# EAGLE design schemat (EAGLE 8.4.3)
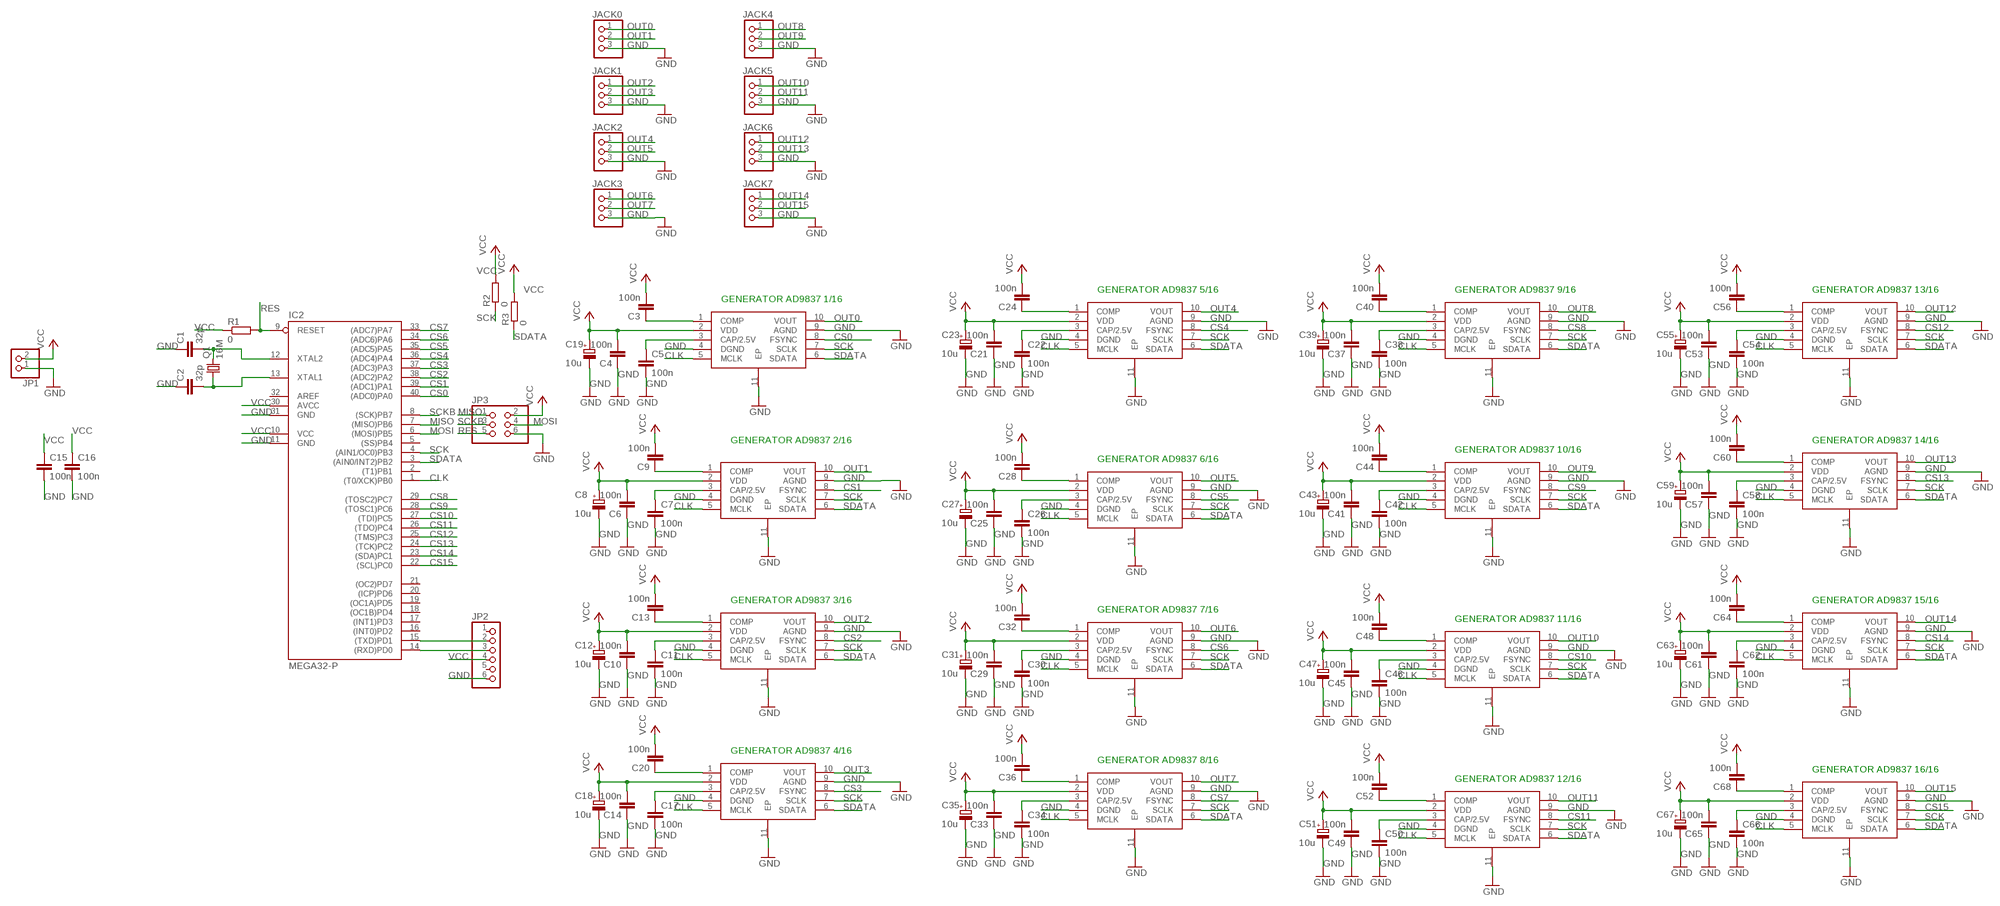
[diagram p0: schematic, sheet 1]

## Parts
C1  32p  C-EUC1206  [C1206]
C2  32p  C-EUC1206  [C1206]
C3  100n  C-EUC1206  [C1206]
C4  100n  C-EUC1206  [C1206]
C5  100n  C-EUC1206  [C1206]
C6  100n  C-EUC1206  [C1206]
C7  100n  C-EUC1206  [C1206]
C8  10u  CPOL-EUSMCB  [SMC_B]
C9  100n  C-EUC1206  [C1206]
C10  100n  C-EUC1206  [C1206]
C11  100n  C-EUC1206  [C1206]
C12  10u  CPOL-EUSMCB  [SMC_B]
C13  100n  C-EUC1206  [C1206]
C14  100n  C-EUC1206  [C1206]
C15  100n  C-EUC1206  [C1206]
C16  100n  C-EUC1206  [C1206]
C17  100n  C-EUC1206  [C1206]
C18  10u  CPOL-EUSMCB  [SMC_B]
C19  10u  CPOL-EUSMCB  [SMC_B]
C20  100n  C-EUC1206  [C1206]
C21  100n  C-EUC1206  [C1206]
C22  100n  C-EUC1206  [C1206]
C23  10u  CPOL-EUSMCB  [SMC_B]
C24  100n  C-EUC1206  [C1206]
C25  100n  C-EUC1206  [C1206]
C26  100n  C-EUC1206  [C1206]
C27  10u  CPOL-EUSMCB  [SMC_B]
C28  100n  C-EUC1206  [C1206]
C29  100n  C-EUC1206  [C1206]
C30  100n  C-EUC1206  [C1206]
C31  10u  CPOL-EUSMCB  [SMC_B]
C32  100n  C-EUC1206  [C1206]
C33  100n  C-EUC1206  [C1206]
C34  100n  C-EUC1206  [C1206]
C35  10u  CPOL-EUSMCB  [SMC_B]
C36  100n  C-EUC1206  [C1206]
C37  100n  C-EUC1206  [C1206]
C38  100n  C-EUC1206  [C1206]
C39  10u  CPOL-EUSMCB  [SMC_B]
C40  100n  C-EUC1206  [C1206]
C41  100n  C-EUC1206  [C1206]
C42  100n  C-EUC1206  [C1206]
C43  10u  CPOL-EUSMCB  [SMC_B]
C44  100n  C-EUC1206  [C1206]
C45  100n  C-EUC1206  [C1206]
C46  100n  C-EUC1206  [C1206]
C47  10u  CPOL-EUSMCB  [SMC_B]
C48  100n  C-EUC1206  [C1206]
C49  100n  C-EUC1206  [C1206]
C50  100n  C-EUC1206  [C1206]
C51  10u  CPOL-EUSMCB  [SMC_B]
C52  100n  C-EUC1206  [C1206]
C53  100n  C-EUC1206  [C1206]
C54  100n  C-EUC1206  [C1206]
C55  10u  CPOL-EUSMCB  [SMC_B]
C56  100n  C-EUC1206  [C1206]
C57  100n  C-EUC1206  [C1206]
C58  100n  C-EUC1206  [C1206]
C59  10u  CPOL-EUSMCB  [SMC_B]
C60  100n  C-EUC1206  [C1206]
C61  100n  C-EUC1206  [C1206]
C62  100n  C-EUC1206  [C1206]
C63  10u  CPOL-EUSMCB  [SMC_B]
C64  100n  C-EUC1206  [C1206]
C65  100n  C-EUC1206  [C1206]
C66  100n  C-EUC1206  [C1206]
C67  10u  CPOL-EUSMCB  [SMC_B]
C68  100n  C-EUC1206  [C1206]
GEN1  AD9837  [SON50P300X300X80-11N]
GEN2  AD9837  [SON50P300X300X80-11N]
GEN3  AD9837  [SON50P300X300X80-11N]
GEN4  AD9837  [SON50P300X300X80-11N]
GEN5  AD9837  [SON50P300X300X80-11N]
GEN6  AD9837  [SON50P300X300X80-11N]
GEN7  AD9837  [SON50P300X300X80-11N]
GEN8  AD9837  [SON50P300X300X80-11N]
GEN9  AD9837  [SON50P300X300X80-11N]
GEN10  AD9837  [SON50P300X300X80-11N]
GEN11  AD9837  [SON50P300X300X80-11N]
GEN12  AD9837  [SON50P300X300X80-11N]
GEN13  AD9837  [SON50P300X300X80-11N]
GEN14  AD9837  [SON50P300X300X80-11N]
GEN15  AD9837  [SON50P300X300X80-11N]
GEN16  AD9837  [SON50P300X300X80-11N]
IC2  MEGA32-P  [DIL40]
JACK0  PINHD-1X3  [1X03]
JACK1  PINHD-1X3  [1X03]
JACK2  PINHD-1X3  [1X03]
JACK3  PINHD-1X3  [1X03]
JACK4  PINHD-1X3  [1X03]
JACK5  PINHD-1X3  [1X03]
JACK6  PINHD-1X3  [1X03]
JACK7  PINHD-1X3  [1X03]
JP1  PINHD-1X2  [1X02]
JP2  PINHD-1X6  [1X06]
JP3  PINHD-2X3  [2X03]
Q1  16M  CRYSTALHC49S  [HC49/S]
R1  0  R-EU_R1206  [R1206]
R2  0  R-EU_M1206  [M1206]
R3  0  R-EU_M1206  [M1206]

## Nets
CLK: GEN1.5(MCLK) GEN2.5(MCLK) GEN3.5(MCLK) GEN4.5(MCLK) GEN5.5(MCLK) GEN6.5(MCLK) GEN7.5(MCLK) GEN8.5(MCLK) GEN9.5(MCLK) GEN10.5(MCLK) GEN11.5(MCLK) GEN12.5(MCLK) GEN13.5(MCLK) GEN14.5(MCLK) GEN15.5(MCLK) GEN16.5(MCLK) IC2.1((T0/XCK)PB0)
CS0: GEN1.8(FSYNC) IC2.40((ADC0)PA0)
CS1: GEN2.8(FSYNC) IC2.39((ADC1)PA1)
CS2: GEN3.8(FSYNC) IC2.38((ADC2)PA2)
CS3: GEN4.8(FSYNC) IC2.37((ADC3)PA3)
CS4: GEN5.8(FSYNC) IC2.36((ADC4)PA4)
CS5: GEN6.8(FSYNC) IC2.35((ADC5)PA5)
CS6: GEN7.8(FSYNC) IC2.34((ADC6)PA6)
CS7: GEN8.8(FSYNC) IC2.33((ADC7)PA7)
CS8: GEN9.8(FSYNC) IC2.29((TOSC2)PC7)
CS9: GEN10.8(FSYNC) IC2.28((TOSC1)PC6)
CS10: GEN11.8(FSYNC) IC2.27((TDI)PC5)
CS11: GEN12.8(FSYNC) IC2.26((TDO)PC4)
CS12: GEN13.8(FSYNC) IC2.25((TMS)PC3)
CS13: GEN14.8(FSYNC) IC2.24((TCK)PC2)
CS14: GEN15.8(FSYNC) IC2.23((SDA)PC1)
CS15: GEN16.8(FSYNC) IC2.22((SCL)PC0)
GND: C1.1 C2.1 C4.1 C5.2 C6.1 C7.2 C8.- C10.1 C11.2 C12.- C14.1 C15.2 C16.2 C17.2 C18.- C19.- C21.1 C22.2 C23.- C25.1 C26.2 C27.- C29.1 C30.2 C31.- C33.1 C34.2 C35.- C37.1 C38.2 C39.- C41.1 C42.2 C43.- C45.1 C46.2 C47.- C49.1 C50.2 C51.- C53.1 C54.2 C55.- C57.1 C58.2 C59.- C61.1 C62.2 C63.- C65.1 C66.2 C67.- GEN1.4(DGND) GEN1.9(AGND) GEN1.11(EP) GEN2.4(DGND) GEN2.9(AGND) GEN2.11(EP) GEN3.4(DGND) GEN3.9(AGND) GEN3.11(EP) GEN4.4(DGND) GEN4.9(AGND) GEN4.11(EP) GEN5.4(DGND) GEN5.9(AGND) GEN5.11(EP) GEN6.4(DGND) GEN6.9(AGND) GEN6.11(EP) GEN7.4(DGND) GEN7.9(AGND) GEN7.11(EP) GEN8.4(DGND) GEN8.9(AGND) GEN8.11(EP) GEN9.4(DGND) GEN9.9(AGND) GEN9.11(EP) GEN10.4(DGND) GEN10.9(AGND) GEN10.11(EP) GEN11.4(DGND) GEN11.9(AGND) GEN11.11(EP) GEN12.4(DGND) GEN12.9(AGND) GEN12.11(EP) GEN13.4(DGND) GEN13.9(AGND) GEN13.11(EP) GEN14.4(DGND) GEN14.9(AGND) GEN14.11(EP) GEN15.4(DGND) GEN15.9(AGND) GEN15.11(EP) GEN16.4(DGND) GEN16.9(AGND) GEN16.11(EP) IC2.11(GND) IC2.31(GND) JACK0.3 JACK1.3 JACK2.3 JACK3.3 JACK4.3 JACK5.3 JACK6.3 JACK7.3 JP1.1 JP2.6 JP3.6
MISO: IC2.7((MISO)PB6) JP3.1
MOSI: IC2.6((MOSI)PB5) JP3.4
N$1: C7.1 GEN2.3(CAP/2.5V)
N$2: C9.1 GEN2.1(COMP)
N$3: C1.2 IC2.12(XTAL2) Q1.2
N$4: C2.2 IC2.13(XTAL1) Q1.1
N$6: C5.1 GEN1.3(CAP/2.5V)
N$7: C11.1 GEN3.3(CAP/2.5V)
N$8: C13.1 GEN3.1(COMP)
N$9: C17.1 GEN4.3(CAP/2.5V)
N$10: C20.1 GEN4.1(COMP)
N$11: C22.1 GEN5.3(CAP/2.5V)
N$12: C24.1 GEN5.1(COMP)
N$14: C3.1 GEN1.1(COMP)
N$15: C26.1 GEN6.3(CAP/2.5V)
N$16: C28.1 GEN6.1(COMP)
N$17: C30.1 GEN7.3(CAP/2.5V)
N$18: C32.1 GEN7.1(COMP)
N$19: C34.1 GEN8.3(CAP/2.5V)
N$20: C36.1 GEN8.1(COMP)
N$21: C38.1 GEN9.3(CAP/2.5V)
N$22: C40.1 GEN9.1(COMP)
N$23: C42.1 GEN10.3(CAP/2.5V)
N$24: C44.1 GEN10.1(COMP)
N$25: C46.1 GEN11.3(CAP/2.5V)
N$26: C48.1 GEN11.1(COMP)
N$27: C50.1 GEN12.3(CAP/2.5V)
N$28: C52.1 GEN12.1(COMP)
N$29: C54.1 GEN13.3(CAP/2.5V)
N$30: C56.1 GEN13.1(COMP)
N$31: C58.1 GEN14.3(CAP/2.5V)
N$32: C60.1 GEN14.1(COMP)
N$33: C62.1 GEN15.3(CAP/2.5V)
N$34: C64.1 GEN15.1(COMP)
N$35: C66.1 GEN16.3(CAP/2.5V)
N$36: C68.1 GEN16.1(COMP)
N$37: IC2.15((TXD)PD1) JP2.2
N$38: IC2.14((RXD)PD0) JP2.3
OUT0: GEN1.10(VOUT) JACK0.1
OUT1: GEN2.10(VOUT) JACK0.2
OUT2: GEN3.10(VOUT) JACK1.1
OUT3: GEN4.10(VOUT) JACK1.2
OUT4: GEN5.10(VOUT) JACK2.1
OUT5: GEN6.10(VOUT) JACK2.2
OUT6: GEN7.10(VOUT) JACK3.1
OUT7: GEN8.10(VOUT) JACK3.2
OUT8: GEN9.10(VOUT) JACK4.1
OUT9: GEN10.10(VOUT) JACK4.2
OUT10: GEN11.10(VOUT) JACK5.1
OUT11: GEN12.10(VOUT) JACK5.2
OUT12: GEN13.10(VOUT) JACK6.1
OUT13: GEN14.10(VOUT) JACK6.2
OUT14: GEN15.10(VOUT) JACK7.1
OUT15: GEN16.10(VOUT) JACK7.2
RES: IC2.9(RESET) JP3.5 R1.2
SCK: GEN1.7(SCLK) GEN2.7(SCLK) GEN3.7(SCLK) GEN4.7(SCLK) GEN5.7(SCLK) GEN6.7(SCLK) GEN7.7(SCLK) GEN8.7(SCLK) GEN9.7(SCLK) GEN10.7(SCLK) GEN11.7(SCLK) GEN12.7(SCLK) GEN13.7(SCLK) GEN14.7(SCLK) GEN15.7(SCLK) GEN16.7(SCLK) IC2.4((AIN1/OC0)PB3) R2.1
SCKB: IC2.8((SCK)PB7) JP3.3
SDATA: GEN1.6(SDATA) GEN2.6(SDATA) GEN3.6(SDATA) GEN4.6(SDATA) GEN5.6(SDATA) GEN6.6(SDATA) GEN7.6(SDATA) GEN8.6(SDATA) GEN9.6(SDATA) GEN10.6(SDATA) GEN11.6(SDATA) GEN12.6(SDATA) GEN13.6(SDATA) GEN14.6(SDATA) GEN15.6(SDATA) GEN16.6(SDATA) IC2.3((AIN0/INT2)PB2) R3.1
VCC: C3.2 C4.2 C6.2 C8.+ C9.2 C10.2 C12.+ C13.2 C14.2 C15.1 C16.1 C18.+ C19.+ C20.2 C21.2 C23.+ C24.2 C25.2 C27.+ C28.2 C29.2 C31.+ C32.2 C33.2 C35.+ C36.2 C37.2 C39.+ C40.2 C41.2 C43.+ C44.2 C45.2 C47.+ C48.2 C49.2 C51.+ C52.2 C53.2 C55.+ C56.2 C57.2 C59.+ C60.2 C61.2 C63.+ C64.2 C65.2 C67.+ C68.2 GEN1.2(VDD) GEN2.2(VDD) GEN3.2(VDD) GEN4.2(VDD) GEN5.2(VDD) GEN6.2(VDD) GEN7.2(VDD) GEN8.2(VDD) GEN9.2(VDD) GEN10.2(VDD) GEN11.2(VDD) GEN12.2(VDD) GEN13.2(VDD) GEN14.2(VDD) GEN15.2(VDD) GEN16.2(VDD) IC2.10(VCC) IC2.30(AVCC) JP1.2 JP2.4 JP3.2 R1.1 R2.2 R3.2
Unconnected: IC2.2((T1)PB1) IC2.5((SS)PB4) IC2.16((INT0)PD2) IC2.17((INT1)PD3) IC2.18((OC1B)PD4) IC2.19((OC1A)PD5) IC2.20((ICP)PD6) IC2.21((OC2)PD7) IC2.32(AREF) JP2.1 JP2.5

## Notes on the sheet
- GENERATOR AD9837 5/16 | GENERATOR AD9837 9/16 | GENERATOR AD9837 13/16
- GENERATOR AD9837 1/16
- GENERATOR AD9837 2/16 | GENERATOR AD9837 14/16
- GENERATOR AD9837 10/16
- GENERATOR AD9837 6/16
- GENERATOR AD9837 3/16 | GENERATOR AD9837 15/16
- GENERATOR AD9837 7/16
- GENERATOR AD9837 11/16
- GENERATOR AD9837 4/16
- GENERATOR AD9837 8/16
- GENERATOR AD9837 16/16
- GENERATOR AD9837 12/16

## Library data of the parts
C1 C2 = rcl:C-EU: CAPACITOR, European symbol
C3-C7 C9-C11 C13-C17 C20-C22 C24-C26 C28-C30 C32-C34 C36-C38 C40-C42 C44-C46 C48-C50 C52-C54 C56-C58 C60-C62 C64-C66 C68 = SON50P300X300X80-11N:C-EU: CAPACITOR, European symbol
C8 C12 C18 C19 C23 C27 C31 C35 C39 C43 C47 C51 C55 C59 C63 C67 = rcl:CPOL-EU: POLARIZED CAPACITOR, European symbol
GEN1 = SON50P300X300X80-11N:AD9837; SPICEPREFIX: X
GEN2-GEN16 = SON50P300X300X80-11N:AD9837
IC2 = atmel:MEGA32-P: MICROCONTROLLER 32 Kbytes FLASH 2 Kbytes SRAM 1 Kbytes EEPROM USART 8-channel 10 bit ADC Source: www.atmel.com .. doc2503.pdf; MPN: ATMEGA32-16PU; OC_FARNELL: 1661729; OC_NEWARK: 51P1794
JACK0 JACK1-JACK7 = pinhead:PINHD-1X3: PIN HEADER
JP1 = pinhead:PINHD-1X2: PIN HEADER
JP2 = pinhead:PINHD-1X6: PIN HEADER
JP3 = pinhead:PINHD-2X3: PIN HEADER
Q1 = crystal:CRYSTAL: CRYSTAL; OC_FARNELL: 1667008; OC_NEWARK: unknown
R1 = rcl:R-EU_: RESISTOR, European symbol
R2 R3 = SON50P300X300X80-11N:R-EU_: RESISTOR, European symbol

## Board
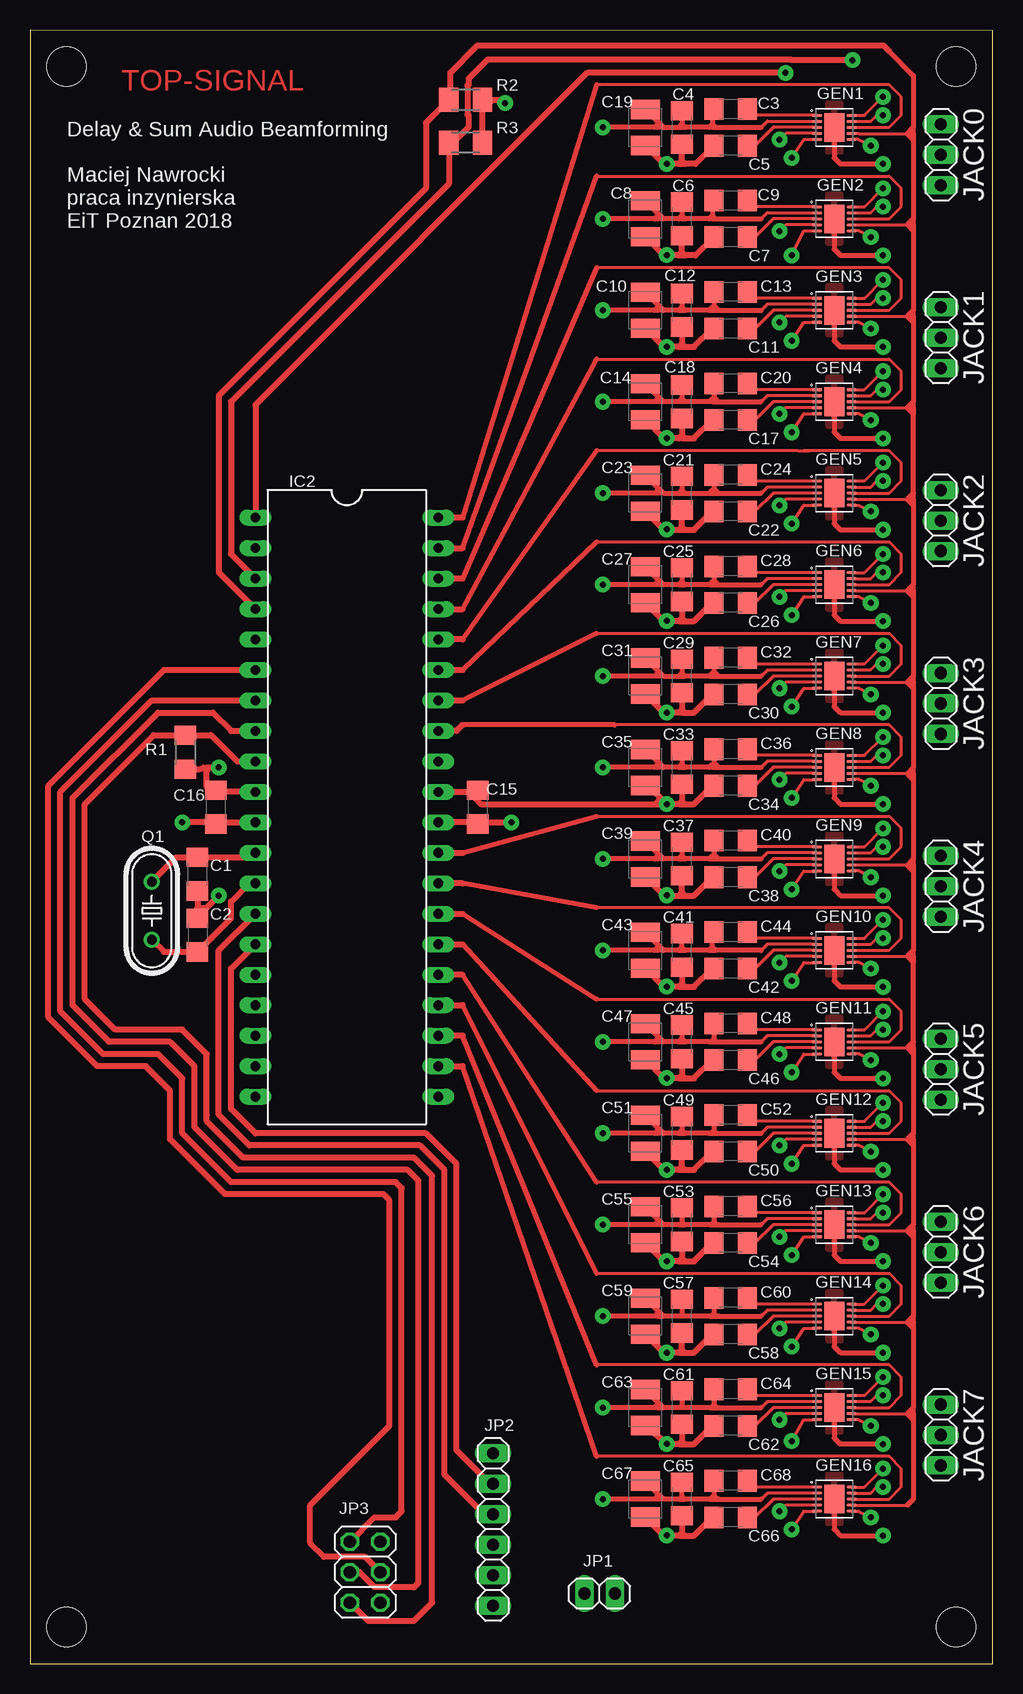
[diagram p1: board, top side]
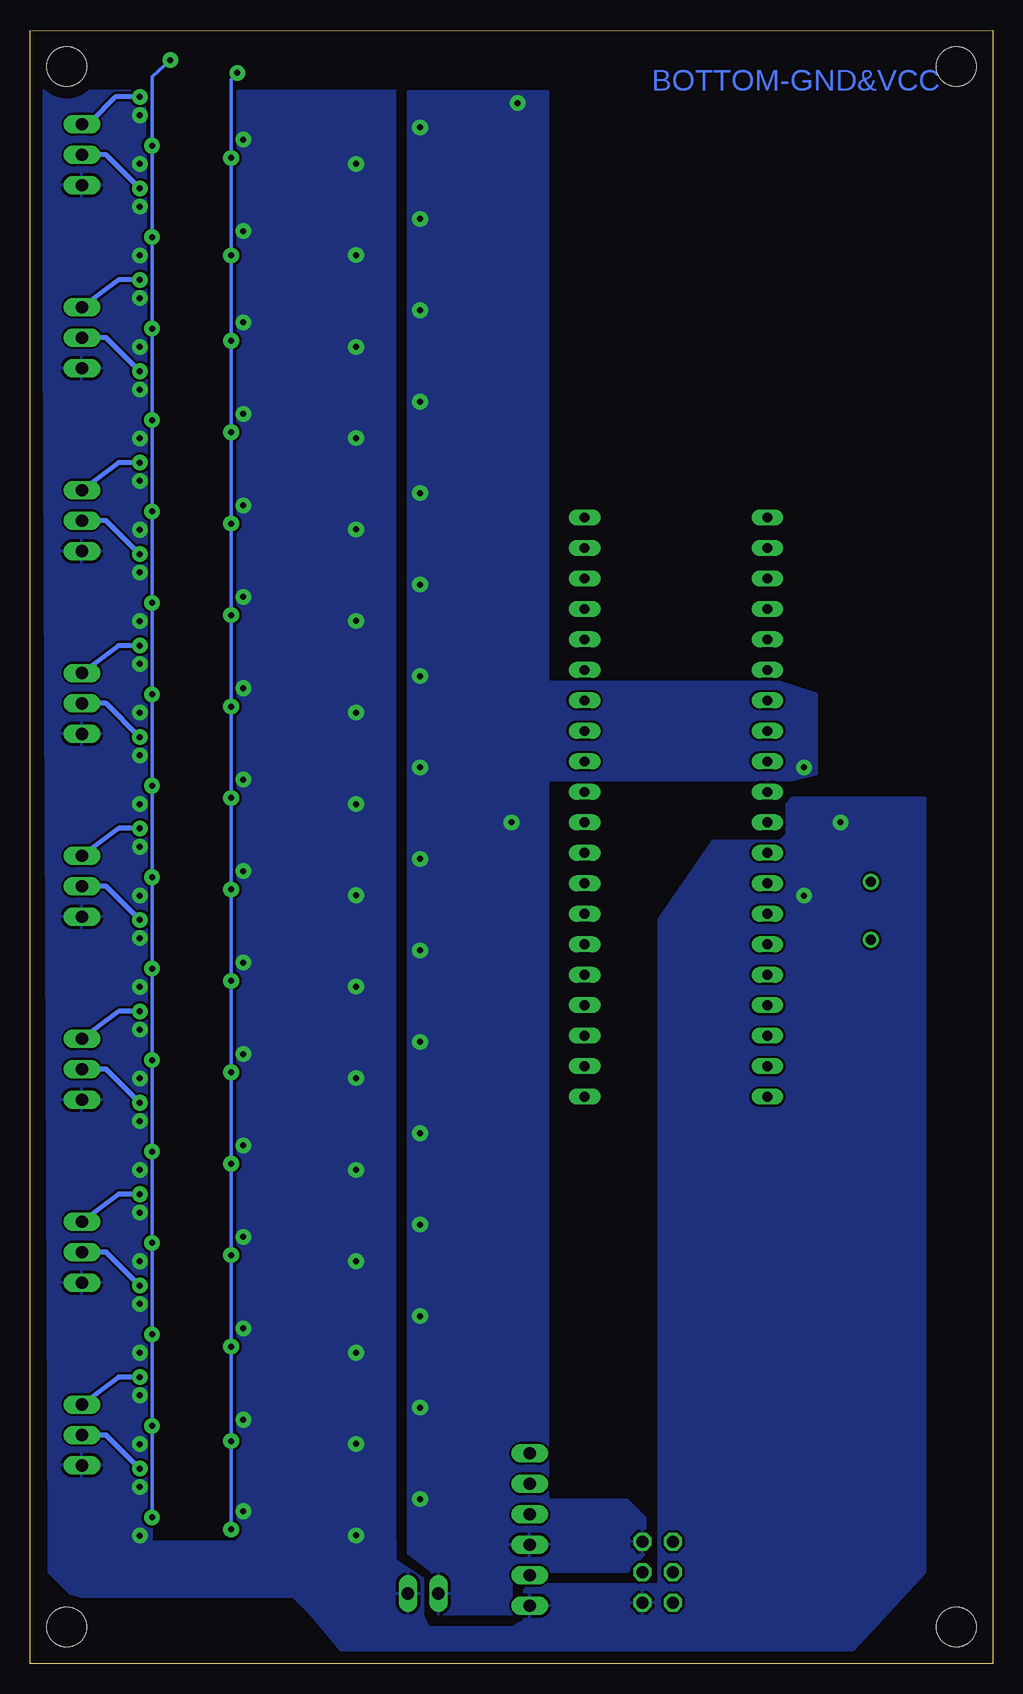
[diagram p2: board, bottom side, seen from below]

Size 80.27 x 136.13 mm. Coordinates in mm from the lower left corner, seen from the top.
Outline: 0,0 80.26,0 80.27,136.07 0,136.13 0,0
Copper layers (1*16): Top 0.035mm / dielectric 1.5mm / Bottom 0.035mm
Design rules "default *": minimum track width 6mil, minimum drill 0.35mm, track to track 8mil, track to pad 8mil, pad to pad 8mil, via to via 8mil, smd to smd 6mil, copper to edge 40mil, drill to drill 6mil, minimum pad ring 10mil, minimum via ring 8mil, stop-mask expansion 4mil, vias tented up to drill 0mil, thermal gap 10mil
Holes 3.3 mm at 77.22,3.05 77.22,133.1 3.05,133.1 3.05,3.05

### Footprints (pad centres in the part's own frame; a part is rotated, then mirrored left to right if it is on the bottom)
C1206 = smd 1.6 x 1.8: 1 -1.4,0; 2 1.4,0
SMC_B = smd 1.6 x 2.4: + -1.5,0; - 1.5,0
SON50P300X300X80-11N = smd 0.84 x 0.27: 1 -1.44,1; 2 -1.44,0.5; 3 -1.44,0; 4 -1.44,-0.5; 5 -1.44,-1; 6 1.44,-1; 7 1.44,-0.5; 8 1.44,0; 9 1.44,0.5; 10 1.44,1 | smd 1.64 x 2.38: 11 0,0
DIL40 = drill 0.813 long: 1 -24.13,-7.62; 2 -21.59,-7.62; 3 -19.05,-7.62; 4 -16.51,-7.62; 5 -13.97,-7.62; 6 -11.43,-7.62; 7 -8.89,-7.62; 8 -6.35,-7.62; 9 -3.81,-7.62; 10 -1.27,-7.62; 11 1.27,-7.62; 12 3.81,-7.62; 13 6.35,-7.62; 14 8.89,-7.62; 15 11.43,-7.62; 16 13.97,-7.62; 17 16.51,-7.62; 18 19.05,-7.62; 19 21.59,-7.62; 20 24.13,-7.62; 21 24.13,7.62; 22 21.59,7.62; 23 19.05,7.62; 24 16.51,7.62; 25 13.97,7.62; 26 11.43,7.62; 27 8.89,7.62; 28 6.35,7.62; 29 3.81,7.62; 30 1.27,7.62; 31 -1.27,7.62; 32 -3.81,7.62; 33 -6.35,7.62; 34 -8.89,7.62; 35 -11.43,7.62; 36 -13.97,7.62; 37 -16.51,7.62; 38 -19.05,7.62; 39 -21.59,7.62; 40 -24.13,7.62
1X03 = drill 1.016 long: 1 -2.54,0; 2 0,0; 3 2.54,0
1X02 = drill 1.016 long: 1 -1.27,0; 2 1.27,0
1X06 = drill 1.016 long: 1 -6.35,0; 2 -3.81,0; 3 -1.27,0; 4 1.27,0; 5 3.81,0; 6 6.35,0
2X03 = drill 1.016 octagon: 1 -2.54,-1.27; 2 -2.54,1.27; 3 0,-1.27; 4 0,1.27; 5 2.54,-1.27; 6 2.54,1.27
HC49/S = drill 0.813: 1 -2.413,0; 2 2.413,0
R1206 = smd 1.6 x 1.803: 1 -1.422,0; 2 1.422,0
M1206 = smd 1.6 x 2: 1 -1.4,0; 2 1.4,0

### Placement (x,y rotation side)
C1  13.97,65.79 90 top
C2  13.97,60.71 270 top
C3  58.42,129.54 180 top
C4  54.36,128.02 90 top
C5  58.42,126.49 180 top
C6  54.36,120.4 90 top
C7  58.42,118.87 180 top
C8  51.31,120.4 270 top
C9  58.42,121.92 180 top
C10  54.36,112.78 90 top
C11  58.42,111.25 180 top
C12  51.31,112.78 270 top
C13  58.42,114.3 180 top
C14  54.36,105.16 90 top
C15  37.34,71.37 90 top
C16  15.49,71.37 270 top
C17  58.42,103.63 180 top
C18  51.31,105.16 270 top
C19  51.31,128.02 270 top
C20  58.42,106.68 180 top
C21  54.36,97.54 90 top
C22  58.42,96.01 180 top
C23  51.31,97.54 270 top
C24  58.42,99.06 180 top
C25  54.36,89.92 90 top
C26  58.42,88.39 180 top
C27  51.31,89.92 270 top
C28  58.42,91.44 180 top
C29  54.36,82.3 90 top
C30  58.42,80.77 180 top
C31  51.31,82.3 270 top
C32  58.42,83.82 180 top
C33  54.36,74.68 90 top
C34  58.42,73.15 180 top
C35  51.31,74.68 270 top
C36  58.42,76.2 180 top
C37  54.36,67.06 90 top
C38  58.42,65.53 180 top
C39  51.31,67.06 270 top
C40  58.42,68.58 180 top
C41  54.36,59.44 90 top
C42  58.42,57.91 180 top
C43  51.31,59.44 270 top
C44  58.42,60.96 180 top
C45  54.36,51.82 90 top
C46  58.42,50.29 180 top
C47  51.31,51.82 270 top
C48  58.42,53.34 180 top
C49  54.36,44.2 90 top
C50  58.42,42.67 180 top
C51  51.31,44.2 270 top
C52  58.42,45.72 180 top
C53  54.36,36.58 90 top
C54  58.42,35.05 180 top
C55  51.31,36.58 270 top
C56  58.42,38.1 180 top
C57  54.36,28.96 90 top
C58  58.42,27.43 180 top
C59  51.31,28.96 270 top
C60  58.42,30.48 180 top
C61  54.36,21.34 90 top
C62  58.42,19.81 180 top
C63  51.31,21.34 270 top
C64  58.42,22.86 180 top
C65  54.36,13.72 90 top
C66  58.42,12.19 180 top
C67  51.31,13.72 270 top
C68  58.42,15.24 180 top
GEN1  67.06,128.02 0 top
GEN2  67.06,120.4 0 top
GEN3  67.06,112.78 0 top
GEN4  67.06,105.16 0 top
GEN5  67.06,97.54 0 top
GEN6  67.06,89.92 0 top
GEN7  67.06,82.3 0 top
GEN8  67.06,74.68 0 top
GEN9  67.06,67.06 0 top
GEN10  67.06,59.44 0 top
GEN11  67.06,51.82 0 top
GEN12  67.06,44.2 0 top
GEN13  67.06,36.58 0 top
GEN14  67.06,28.96 0 top
GEN15  67.06,21.34 0 top
GEN16  67.06,13.72 0 top
IC2  26.42,71.37 270 top
JACK0  75.95,125.73 270 top
JACK1  75.95,110.49 270 top
JACK2  75.95,95.25 270 top
JACK3  75.95,80.01 270 top
JACK4  75.95,64.77 270 top
JACK5  75.95,49.53 270 top
JACK6  75.95,34.29 270 top
JACK7  75.95,19.05 270 top
JP1  47.5,5.84 180 top
JP2  38.61,11.18 270 top
JP3  27.94,7.62 270 top
Q1  10.16,62.74 90 top
R1  12.95,75.95 90 top
R2  36.32,130.3 0 top
R3  36.32,126.75 0 top

### Tracks (layer width: path | path; a pad name or v marks a point on that pad's centre or on a via)
CLK  (via drill 0.5 pad 1.3)
  Top 0.254: GEN1.5 65.6,127 64.52,127 v63.5,125.48 | v63.5,117.35 64.53,119.4 GEN2.5 | v63.5,110.24 64.53,111.78 GEN3.5 | v63.5,102.62 64.53,104.16 GEN4.5 | v63.5,95 64.53,96.54 GEN5.5 | v63.5,87.38 64.53,88.92 GEN6.5 | v63.5,79.76 64.53,81.3 GEN7.5 | v63.5,72.14 64.52,73.66 65.6,73.66 GEN8.5 | v63.5,64.52 64.52,66.04 65.6,66.04 GEN9.5 | v63.5,56.9 64.52,58.42 65.6,58.42 GEN10.5 | v63.5,49.28 64.52,50.8 65.6,50.8 GEN11.5 | v63.5,41.66 64.52,43.18 65.6,43.18 GEN12.5 | v63.5,34.04 64.52,35.56 65.6,35.56 GEN13.5 | v63.5,26.42 64.52,27.94 65.6,27.94 GEN14.5 | v63.5,18.54 64.52,20.32 65.47,20.32 GEN15.5 | v63.5,11.18 64.52,12.7 65.6,12.7 GEN16.5 | 62.99,132.23 v62.99,132.56
  Top 0.508: v62.99,132.56 46.45,132.56 18.8,104.9 IC2.1
  Bottom 0.254: v62.99,132.56 62.99,132.48 63.5,131.98
  Bottom 0.305: v63.5,11.18 v63.5,18.54 v63.5,26.42 v63.5,34.04 v63.5,41.66 v63.5,49.28 v63.5,56.9 v63.5,64.52 v63.5,72.14 v63.5,79.76 v63.5,87.38 v63.5,95 v63.5,102.62 v63.5,110.24 v63.5,117.35 v63.5,125.48 63.5,131.98
CS0
  Top 0.254: GEN1.8 71.63,128.02 72.64,129.03 72.64,130.56 71.63,131.57 47.24,131.57
  Top 0.406: 47.24,131.57 36.07,95.5
  Top 0.508: 36.07,95.5 IC2.40
CS1
  Top 0.254: GEN2.8 71.63,120.4 72.64,121.41 72.64,122.94 71.63,123.95 47.24,123.95
  Top 0.406: 36.07,92.96 47.24,123.95
  Top 0.508: IC2.39 36.07,92.96
CS2
  Top 0.254: GEN3.8 71.63,112.78 72.64,113.79 72.64,115.32 71.63,116.33 47.24,116.33
  Top 0.406: 47.24,116.33 36.07,90.42
  Top 0.508: 36.07,90.42 IC2.38
CS3
  Top 0.254: GEN4.8 71.63,105.16 72.64,106.17 72.64,107.7 71.63,108.71 47.24,108.71
  Top 0.406: 36.07,87.88 47.24,108.71
  Top 0.508: IC2.37 36.07,87.88
CS4
  Top 0.254: GEN5.8 71.63,97.54 72.64,98.55 72.64,100.08 71.63,101.09 65.53,101.09 65.02,101.09 | 65.02,101.09 64.52,101.09 | 65.02,101.09 64.01,101.09 47.24,101.09
  Top 0.406: 47.24,101.09 36.07,85.34
  Top 0.508: 36.07,85.34 IC2.36
CS5
  Top 0.254: GEN6.8 71.63,89.92 72.64,90.93 72.64,92.46 71.63,93.47 47.24,93.47
  Top 0.406: 36.07,82.8 47.24,93.47
  Top 0.508: IC2.35 36.07,82.8
CS6
  Top 0.254: GEN7.8 71.63,82.3 72.64,83.31 72.64,84.84 71.63,85.85 47.24,85.85
  Top 0.406: 36.07,80.26 47.24,85.85
  Top 0.508: IC2.34 36.07,80.26
CS7
  Top 0.254: GEN8.8 71.63,74.68 72.64,75.69 72.64,77.22 71.63,78.23 48.77,78.23
  Top 0.406: 48.77,78.23 36.07,78.23
  Top 0.508: 36.07,78.23 35.56,77.72 IC2.33
CS8
  Top 0.254: GEN9.8 71.63,67.06 72.64,68.07 72.64,69.6 71.63,70.61 47.24,70.61
  Top 0.406: 36.07,67.56 47.24,70.61
  Top 0.508: IC2.29 36.07,67.56
CS9
  Top 0.254: GEN10.8 71.63,59.44 72.64,60.45 72.64,61.98 71.63,62.99 47.24,62.99
  Top 0.406: 47.24,62.99 36.07,65.02
  Top 0.508: 36.07,65.02 IC2.28
CS10
  Top 0.254: GEN11.8 71.63,51.82 72.64,52.83 72.64,54.36 71.63,55.37 47.24,55.37
  Top 0.406: 36.07,62.48 47.24,55.37
  Top 0.508: IC2.27 36.07,62.48
CS11
  Top 0.254: GEN12.8 71.63,44.2 72.64,45.21 72.64,46.74 71.63,47.75 47.24,47.75
  Top 0.406: 36.07,59.94 47.24,47.75
  Top 0.508: IC2.26 36.07,59.94
CS12
  Top 0.254: GEN13.8 71.63,36.58 72.64,37.59 72.64,39.12 71.63,40.13 47.24,40.13
  Top 0.406: 47.24,40.13 36.07,57.4
  Top 0.508: 36.07,57.4 IC2.25
CS13
  Top 0.254: GEN14.8 71.63,28.96 72.64,29.97 72.64,31.5 71.63,32.51 47.24,32.51
  Top 0.406: 36.07,54.86 47.24,32.51
  Top 0.508: IC2.24 36.07,54.86
CS14
  Top 0.254: GEN15.8 71.63,21.34 72.64,22.35 72.64,23.88 71.63,24.89 47.24,24.89
  Top 0.406: 47.24,24.89 36.07,52.32
  Top 0.508: 36.07,52.32 IC2.23
CS15
  Top 0.254: GEN16.8 71.63,13.72 72.64,14.73 72.64,16.26 71.63,17.27 47.24,17.27
  Top 0.406: 47.24,17.27 36.07,49.78
  Top 0.508: IC2.22 36.07,49.78
GND  (via drill 0.5 pad 1.3)
  Top 0.152: 15.62,69.97 15.75,70.1
  Top 0.254: GEN1.4 63,127.52 v62.48,127 | GEN2.4 63,119.9 v62.48,119.38 | GEN3.4 63,112.28 v62.48,111.76 | GEN4.4 62.99,104.65 v62.48,104.14 | GEN5.4 63,97.04 v62.48,96.52 | GEN6.4 63,89.42 v62.48,88.9 | GEN7.4 63,81.8 v62.48,81.28 | GEN8.4 63,74.18 v62.48,73.66 | GEN9.4 63,66.56 v62.48,66.04 | GEN10.4 63,58.94 v62.48,58.42 | GEN11.4 63,51.32 v62.48,50.8 | GEN12.4 63,43.7 v62.48,43.18 | GEN13.4 63,36.08 v62.48,35.56 | GEN14.4 63,28.46 v62.48,27.94 | GEN15.4 63,20.84 v62.48,20.32 | GEN16.4 63,13.22 v62.48,12.7 | C15.2 37.34,72.39 | 52.83,56.39 v53.09,56.41 | 52.83,102.11 v53.09,102.13 | GEN16.9 70.1,14.22 70.61,14.73 v71.12,14.73 | GEN15.9 70.1,21.84 70.62,22.36 v71.11,22.36 | GEN14.9 70.1,29.46 70.62,29.98 v71.11,29.98 | GEN13.9 70.1,37.08 70.61,37.59 v71.12,37.59 | GEN12.9 70.1,44.7 70.61,45.21 v71.12,45.21 | GEN11.9 70.1,52.32 70.61,52.83 v71.12,52.83 | GEN10.9 70.1,59.94 70.61,60.45 v71.12,60.45 | GEN9.9 70.1,67.56 70.61,68.07 v71.12,68.07 | GEN8.9 70.1,75.18 70.61,75.69 v71.12,75.69 | GEN7.9 70.1,82.8 70.61,83.31 v71.12,83.31 | GEN6.9 70.1,90.42 70.61,90.93 v71.12,90.93 | GEN5.9 70.1,98.04 70.61,98.55 v71.12,98.55 | GEN4.9 70.1,105.66 70.61,106.17 v71.12,106.17 | GEN3.9 70.1,113.28 70.61,113.79 v71.12,113.79 | GEN2.9 70.1,120.9 70.61,121.41 v71.12,121.41 | GEN1.9 70.1,128.52 70.61,129.03 v71.12,129.03
  Top 0.305: 54.36,124.97 54.36,125.22 | 52.83,124.99 v53.09,124.97 | 52.83,117.35 v53.09,117.37 | 54.36,117.35 54.1,117.35 | 54.36,117.35 54.36,117.6 | 52.83,109.75 v53.09,109.73 | 52.83,94.49 v53.09,94.51 | 52.83,86.87 v53.09,86.89 | 54.36,86.87 54.1,86.87 | 54.36,86.87 54.61,86.87 | 56.9,88.39 C26.2 | 56.9,80.77 C30.2 | v53.09,79.25 52.83,79.27 | 54.36,79.5 54.36,79.25 | C35.- 51.31,73.15 | 54.1,71.63 54.36,71.63 54.61,71.63 | 56.9,73.15 C34.2 | 52.83,64.01 v53.09,64.03 | 54.1,64.01 54.36,64.01 54.61,64.01 | 56.9,65.53 C38.2 | 54.36,56.39 54.1,56.39 | 54.36,56.39 54.61,56.39 | 56.9,57.91 C42.2 | 54.36,56.64 54.36,56.39 | 52.83,48.77 v53.09,48.79 | 54.36,48.77 54.1,48.77 | 54.36,48.77 54.61,48.77 | 56.9,50.29 C46.2 | 54.36,49.02 54.36,48.77 | 54.1,41.15 54.36,41.15 54.61,41.15 | v53.09,41.15 52.83,41.17 | 54.1,33.53 54.36,33.53 | 54.36,33.53 54.61,33.53 | 54.36,33.78 54.36,33.53 | 52.83,33.55 v53.09,33.53 | 54.1,25.91 54.36,25.91 54.61,25.91 | v53.09,18.31 53.09,18.29 | 54.1,10.67 54.36,10.67 | 54.36,10.67 54.61,10.67 | 54.36,10.92 54.36,10.67 | 54.36,87.12 54.36,86.87 | 54.61,117.35 54.36,117.35 | 56.9,12.19 C66.2 | 56.9,19.81 C62.2 | 56.9,27.43 C58.2 | 56.9,35.05 C54.2 | 56.9,42.67 C50.2 | 56.9,96.01 C22.2 | 56.9,103.63 C17.2 | 56.9,111.25 C11.2 | 37.08,72.14 36.58,72.64
  Top 0.356: 52.58,72.14 52.07,71.63
  Top 0.406: 54.36,94.49 54.36,94.74 | 54.36,71.88 54.36,71.63 | 54.36,64.01 54.36,64.26 | GEN2.11 67.06,117.86 67.56,117.35 v71.12,117.35 | GEN1.11 67.06,125.48 67.56,124.97 v71.12,124.97 | GEN3.11 67.06,110.24 67.56,109.73 v71.12,109.73 | GEN4.11 67.06,102.62 67.56,102.11 v71.12,102.11 | GEN5.11 67.06,95 67.56,94.49 v71.12,94.49 | GEN6.11 67.06,87.38 67.56,86.87 v71.12,86.87 | GEN7.11 67.06,79.76 67.56,79.25 v71.12,79.25 | GEN8.11 67.06,72.14 67.56,71.63 v71.12,71.63 | GEN9.11 67.06,64.52 67.56,64.01 v71.12,64.01 | GEN10.11 67.06,56.9 67.56,56.39 v71.12,56.39 | GEN11.11 67.06,49.28 67.56,48.77 v71.12,48.77 | GEN13.11 67.06,34.04 67.56,33.53 v71.12,33.53 | GEN14.11 67.06,26.42 67.56,25.91 v71.12,25.91 | GEN16.11 67.06,11.18 67.56,10.67 v71.12,10.67 | GEN15.11 67.06,18.8 67.56,18.29 v71.12,18.29 | GEN12.11 67.06,41.66 67.56,41.15 v71.12,41.15 | v53.09,10.69 52.83,10.69 | v53.09,33.53 52.86,33.53 | v53.09,41.15 52.86,41.15 | v53.09,48.79 52.83,48.79 | v53.09,56.41 52.83,56.41 | v53.09,79.25 52.86,79.25 | v53.09,86.89 52.83,86.89 | v53.09,94.51 52.83,94.51 | v53.09,102.13 52.83,102.13 | v53.09,109.73 52.86,109.73 | v53.09,117.37 52.83,117.37 | v53.09,124.97 52.86,124.97 | 13.97,62.99 C2.1
  Top 0.508: 54.36,125.22 C4.1 | 54.1,124.97 v53.09,124.97 | 54.1,124.97 54.36,124.97 54.61,124.97 | 54.1,117.35 52.83,117.35 | 54.36,117.6 C6.1 | 54.1,109.73 v53.09,109.73 | 54.1,109.73 54.36,109.73 | 54.36,109.73 54.61,109.73 | 54.61,109.73 55.37,109.73 56.9,111.25 | C10.1 54.36,109.98 | 54.36,109.98 54.36,109.73 | 54.36,102.11 54.1,102.11 | 54.1,102.11 52.83,102.11 | 54.36,102.11 54.61,102.11 | 54.61,102.11 55.37,102.11 56.9,103.63 | C14.1 54.36,102.36 | 54.36,102.36 54.36,102.11 | 52.83,94.49 54.1,94.49 | 54.1,94.49 54.36,94.49 54.61,94.49 | 54.36,94.74 C21.1 | 54.61,94.49 55.37,94.49 56.9,96.01 | 54.1,86.87 52.83,86.87 | 54.61,86.87 55.37,86.87 56.9,88.39 | 54.61,79.25 54.36,79.25 54.1,79.25 | 54.61,79.25 55.37,79.25 56.9,80.77 | 54.1,79.25 v53.09,79.25 | C29.1 54.36,79.5 | 54.1,71.63 v53.09,71.63 | 54.61,71.63 55.37,71.63 56.9,73.15 | C33.1 54.36,71.88 | 52.83,64.01 54.1,64.01 | 54.36,64.26 C37.1 | 54.61,64.01 55.37,64.01 56.9,65.53 | 54.1,56.39 52.83,56.39 | 54.61,56.39 55.37,56.39 56.9,57.91 | C41.1 54.36,56.64 | 54.1,48.77 52.83,48.77 | 54.61,48.77 55.37,48.77 56.9,50.29 | C45.1 54.36,49.02 | 54.1,41.15 v53.09,41.15 | 54.61,41.15 55.37,41.15 56.9,42.67 | 54.36,41.15 54.36,41.4 | 54.36,41.4 C49.1 | 54.1,33.53 v53.09,33.53 | 54.61,33.53 55.37,33.53 56.9,35.05 | C53.1 54.36,33.78 | 54.1,25.91 v53.09,25.91 | 54.36,25.91 54.36,26.16 | 54.36,26.16 C57.1 | 54.61,25.91 55.37,25.91 56.9,27.43 | 54.1,18.29 53.09,18.29 | 54.1,18.29 54.36,18.29 | 54.61,18.29 55.37,18.29 56.9,19.81 | C63.- v53.09,18.31 | C61.1 54.36,18.54 | v53.09,10.69 52.83,10.67 54.1,10.67 | 54.61,10.67 55.37,10.67 56.9,12.19 | C65.1 54.36,10.92 | C25.1 54.36,87.12 | C5.2 55.5,124.97 54.61,124.97 | C7.2 55.5,117.35 54.61,117.35
  Top 0.508: IC2.31 36.58,72.64 | v53.09,71.63 52.07,71.63 37.59,71.63 37.08,72.14 37.34,72.39 | C1.1 13.97,62.99 14.73,62.99 v15.75,64.01 | v12.7,70.1 15.75,70.1 IC2.11 | C16.2 15.62,69.97 | 54.36,125.22 54.1,124.97 | 54.36,125.22 54.61,124.97 | 54.36,117.6 54.1,117.35 | 54.1,117.35 54.61,117.35 | 54.61,117.35 54.36,117.6 | 54.1,109.73 54.36,109.98 | 54.36,109.98 54.61,109.73 | 54.1,102.11 54.36,102.36 | 54.36,102.36 54.61,102.11 | 54.1,94.49 54.36,94.74 | 54.36,94.74 54.61,94.49 | 54.36,87.12 54.1,86.87 | 54.1,86.87 54.61,86.87 | 54.61,86.87 54.36,87.12 | 54.1,79.25 54.36,79.5 | 54.36,79.5 54.61,79.25 | 54.36,71.88 54.1,71.63 | 54.1,71.63 54.61,71.63 | 54.61,71.63 54.36,71.88 | 54.36,64.26 54.1,64.01 | 54.1,64.01 54.61,64.01 | 54.61,64.01 54.36,64.26 | 54.36,56.64 54.1,56.39 | 54.1,56.39 54.61,56.39 | 54.61,56.39 54.36,56.64 | 54.36,49.02 54.1,48.77 | 54.1,48.77 54.61,48.77 | 54.61,48.77 54.36,49.02 | 54.36,41.4 54.1,41.15 | 54.1,41.15 54.61,41.15 | 54.61,41.15 54.36,41.4 | 54.36,33.78 54.1,33.53 | 54.1,33.53 54.61,33.53 | 54.61,33.53 54.36,33.78 | 54.36,26.16 54.1,25.91 | 54.1,25.91 54.61,25.91 | 54.61,25.91 54.36,26.16 | 54.36,18.54 54.36,18.29 | 54.36,18.29 54.61,18.29 | 54.61,18.29 54.36,18.54 | 54.36,10.92 54.1,10.67 | 54.1,10.67 54.61,10.67 | 54.61,10.67 54.36,10.92 | 54.36,18.54 54.1,18.29 | 52.83,10.69 C67.- | 52.86,33.53 C55.- | 52.86,41.15 C51.- | 52.83,48.79 C47.- | 52.83,56.41 C43.- | v53.09,64.03 52.83,64.03 C39.- | 52.86,79.25 C31.- | 52.83,86.89 C27.- | 52.83,94.51 C23.- | 52.83,102.13 C18.- | 52.86,109.73 C12.- | 52.83,117.37 C8.- | 52.86,124.97 C19.- | v53.09,71.63 52.58,72.14 51.54,73.18 C35.- | v53.09,25.91 53.06,25.93 52.83,25.93 | v53.09,25.91 52.86,25.91 C59.-
  pour Bottom: 70.61,131.06 79.25,131.06 78.74,10.16 70.1,10.16
  pour Bottom: 62.99,131.06 62.99,10.16 49.78,10.16 49.78,131.06
  pour Bottom: 49.78,10.16 49.78,8.64 47.5,7.11 47.5,4.06 56.9,4.06 62.99,10.16
  pour Bottom: 62.99,10.16 78.74,10.16 78.74,7.62 76.71,5.59 58.42,5.59
  pour Bottom: 39.12,6.1 39.12,3.56 40.13,3.05 46.99,3.05 47.5,4.06 56.9,4.06 54.36,1.02 33.02,1.02 30.99,3.56 30.99,6.6 38.61,6.6
  pour Bottom: 33.02,1.02 11.68,1.02 5.59,7.62 5.59,72.14 16.76,72.14 17.27,71.63 17.27,69.09 17.78,68.58 23.37,68.58 27.94,61.98 27.94,6.6 30.99,6.6 30.99,3.56
  pour Top: 66.55,130.05 67.56,130.05 67.56,125.98 66.55,125.98
  pour Top: 66.55,122.43 67.56,122.43 67.56,118.36 66.55,118.36
  pour Top: 66.55,114.81 67.56,114.81 67.56,110.74 66.55,110.74
  pour Top: 66.55,107.19 67.56,107.19 67.56,103.12 66.55,103.12
  pour Top: 66.55,99.57 67.56,99.57 67.56,95.5 66.55,95.5
  pour Top: 66.55,91.95 67.56,91.95 67.56,87.88 66.55,87.88
  pour Top: 66.55,84.33 67.56,84.33 67.56,80.26 66.55,80.26
  pour Top: 66.55,76.71 67.56,76.71 67.56,72.64 66.55,72.64
  pour Top: 66.55,69.09 67.56,69.09 67.56,65.02 66.55,65.02
  pour Top: 66.55,61.47 67.56,61.47 67.56,57.4 66.55,57.4
  pour Top: 66.55,53.85 67.56,53.85 67.56,49.78 66.55,49.78
  pour Top: 66.55,46.23 67.56,46.23 67.56,42.16 66.55,42.16
  pour Top: 66.55,38.61 67.56,38.61 67.56,34.54 66.55,34.54
  pour Top: 66.55,30.99 67.56,30.99 67.56,26.92 66.55,26.92
  pour Top: 66.55,23.37 67.56,23.37 67.56,19.3 66.55,19.3
  pour Top: 66.55,15.75 67.56,15.75 67.56,11.68 66.55,11.68
MISO
  Top 0.508: JP3.1 28.7,12.19 30.48,12.19 30.99,12.7 30.99,39.62 30.48,40.13 16.76,40.13 12.7,44.2 12.7,48.77 10.67,50.8 6.1,50.8 2.54,54.36 2.54,72.64 10.16,80.26 IC2.7
MOSI
  Top 0.508: JP3.4 27.94,8.89 24.51,8.89 23.37,10.03 23.37,13.21 29.97,19.81 29.97,38.61 29.46,39.12 16.26,39.12 11.68,43.69 11.68,47.75 9.65,49.78 5.59,49.78 1.52,53.85 1.52,73.15 11.18,82.8 IC2.6
N$1
  Top 0.254: GEN2.3 61.98,120.4
  Top 0.305: 61.98,120.4 60.45,118.87 C7.1
N$2
  Top 0.254: GEN2.1 60.34,121.4
  Top 0.305: 60.34,121.4 C9.1
N$3
  Top 0.254: 18.42,67.19 IC2.12
  Top 0.508: 18.42,67.19 C1.2 12.2,67.19 Q1.2
N$4
  Top 0.254: 18.29,65.02 IC2.13
  Top 0.508: 18.29,65.02 16.76,63.5 16.76,62.1 C2.2 11.18,59.31 Q1.1
N$6
  Top 0.254: GEN1.3 61.98,128.02
  Top 0.305: 61.98,128.02 60.45,126.49 C5.1
N$7
  Top 0.254: GEN3.3 61.98,112.78
  Top 0.305: 61.98,112.78 60.45,111.25 C11.1
N$8
  Top 0.254: GEN3.1 60.34,113.78
  Top 0.305: 60.34,113.78 C13.1
N$9
  Top 0.254: GEN4.3 61.98,105.16
  Top 0.305: 61.98,105.16 60.45,103.63 C17.1
N$10
  Top 0.254: GEN4.1 60.34,106.16
  Top 0.305: 60.34,106.16 C20.1
N$11
  Top 0.254: GEN5.3 61.98,97.54
  Top 0.305: 61.98,97.54 60.45,96.01 C22.1
N$12
  Top 0.254: GEN5.1 60.34,98.54
  Top 0.305: 60.34,98.54 C24.1
N$14
  Top 0.254: GEN1.1 60.34,129.02
  Top 0.305: 60.34,129.02 C3.1
N$15
  Top 0.254: GEN6.3 61.98,89.92
  Top 0.305: 61.98,89.92 60.45,88.39 C26.1
N$16
  Top 0.254: GEN6.1 60.34,90.92
  Top 0.305: 60.34,90.92 C28.1
N$17
  Top 0.254: GEN7.3 61.98,82.3
  Top 0.305: 61.98,82.3 60.45,80.77 C30.1
N$18
  Top 0.254: GEN7.1 60.34,83.3
  Top 0.305: 60.34,83.3 C32.1
N$19
  Top 0.254: GEN8.3 61.98,74.68
  Top 0.305: 61.98,74.68 60.45,73.15 C34.1
N$20
  Top 0.254: GEN8.1 60.34,75.68
  Top 0.305: 60.34,75.68 C36.1
N$21
  Top 0.254: GEN9.3 61.98,67.06
  Top 0.305: 61.98,67.06 60.45,65.53 C38.1
N$22
  Top 0.254: GEN9.1 60.34,68.06
  Top 0.305: 60.34,68.06 C40.1
N$23
  Top 0.254: GEN10.3 61.98,59.44
  Top 0.305: 61.98,59.44 60.45,57.91 C42.1
N$24
  Top 0.254: GEN10.1 60.34,60.44
  Top 0.305: 60.34,60.44 C44.1
N$25
  Top 0.254: GEN11.3 61.98,51.82
  Top 0.305: 61.98,51.82 60.45,50.29 C46.1
N$26
  Top 0.254: GEN11.1 60.34,52.82
  Top 0.305: 60.34,52.82 C48.1
N$27
  Top 0.254: GEN12.3 61.98,44.2
  Top 0.305: 61.98,44.2 60.45,42.67 C50.1
N$28
  Top 0.254: GEN12.1 60.34,45.2
  Top 0.305: 60.34,45.2 C52.1
N$29
  Top 0.254: GEN13.3 61.98,36.58
  Top 0.305: 61.98,36.58 60.45,35.05 C54.1
N$30
  Top 0.254: GEN13.1 60.34,37.58
  Top 0.305: 60.34,37.58 C56.1
N$31
  Top 0.254: GEN14.3 61.98,28.96
  Top 0.305: 61.98,28.96 60.45,27.43 C58.1
N$32
  Top 0.254: GEN14.1 60.34,29.96
  Top 0.305: 60.34,29.96 C60.1
N$33
  Top 0.254: GEN15.3 61.98,21.34
  Top 0.305: 61.98,21.34 60.45,19.81 C62.1
N$34
  Top 0.254: GEN15.1 60.34,22.34
  Top 0.305: 60.34,22.34 C64.1
N$35
  Top 0.254: GEN16.3 61.98,13.72
  Top 0.305: 61.98,13.72 60.45,12.19 C66.1
N$36
  Top 0.254: GEN16.1 60.34,14.72
  Top 0.305: 60.34,14.72 C68.1
N$37
  Top 0.508: JP2.2 38.35,14.99 35.56,17.78 35.56,41.66 33.02,44.2 18.8,44.2 16.76,46.23 16.76,57.91 IC2.15
N$38
  Top 0.508: JP2.3 37.85,12.45 34.54,15.75 34.54,41.15 32.51,43.18 18.29,43.18 15.75,45.72 15.75,59.44 IC2.14
OUT0  (via drill 0.5 pad 1.3)
  Top 0.254: GEN1.10 69.58,129.02 v71.12,130.56
  Bottom 0.254: 75.18,128.52 JACK0.1
  Bottom 0.406: v71.12,130.56 73.15,130.56 75.18,128.52
OUT1  (via drill 0.5 pad 1.3)
  Top 0.254: GEN2.10 68.51,121.41 69.6,121.41 v71.12,122.94
  Bottom 0.406: JACK0.2 73.91,125.73 v71.12,122.94
OUT2  (via drill 0.5 pad 1.3)
  Top 0.254: GEN3.10 68.51,113.79 69.6,113.79 v71.12,115.32
  Bottom 0.406: v71.12,115.32 72.9,115.32 JACK1.1
OUT3  (via drill 0.5 pad 1.3)
  Top 0.254: GEN4.10 69.58,106.16 v71.12,107.7
  Bottom 0.406: v71.12,107.7 73.91,110.49 JACK1.2
OUT4  (via drill 0.5 pad 1.3)
  Top 0.254: GEN5.10 68.51,98.55 69.6,98.55 v71.12,100.08
  Bottom 0.406: v71.12,100.08 72.9,100.08 JACK2.1
OUT5  (via drill 0.5 pad 1.3)
  Top 0.254: GEN6.10 69.58,90.92 v71.12,92.46
  Bottom 0.406: v71.12,92.46 73.91,95.25 JACK2.2
OUT6  (via drill 0.5 pad 1.3)
  Top 0.254: GEN7.10 68.51,83.31 69.6,83.31 v71.12,84.84
  Bottom 0.406: v71.12,84.84 72.9,84.84 JACK3.1
OUT7  (via drill 0.5 pad 1.3)
  Top 0.254: GEN8.10 69.58,75.68 v71.12,77.22
  Bottom 0.406: v71.12,77.22 73.91,80.01 JACK3.2
OUT8  (via drill 0.5 pad 1.3)
  Top 0.254: GEN9.10 68.51,68.07 69.6,68.07 v71.12,69.6
  Bottom 0.406: v71.12,69.6 72.9,69.6 JACK4.1
OUT9  (via drill 0.5 pad 1.3)
  Top 0.254: GEN10.10 69.58,60.44 v71.12,61.98
  Bottom 0.406: v71.12,61.98 73.91,64.77 JACK4.2
OUT10  (via drill 0.5 pad 1.3)
  Top 0.254: GEN11.10 68.51,52.83 69.6,52.83 v71.12,54.36
  Bottom 0.406: v71.12,54.36 72.9,54.36 JACK5.1
OUT11  (via drill 0.5 pad 1.3)
  Top 0.254: GEN12.10 69.58,45.2 v71.12,46.74
  Bottom 0.406: v71.12,46.74 73.91,49.53 JACK5.2
OUT12  (via drill 0.5 pad 1.3)
  Top 0.254: GEN13.10 68.51,37.59 69.6,37.59 v71.12,39.12
  Bottom 0.406: v71.12,39.12 72.9,39.12 JACK6.1
OUT13  (via drill 0.5 pad 1.3)
  Top 0.254: GEN14.10 69.58,29.96 v71.12,31.5
  Bottom 0.406: v71.12,31.5 73.91,34.29 JACK6.2
OUT14  (via drill 0.5 pad 1.3)
  Top 0.254: GEN15.10 68.51,22.35 69.6,22.35 v71.12,23.88
  Bottom 0.406: v71.12,23.88 72.9,23.88 JACK7.1
OUT15  (via drill 0.5 pad 1.3)
  Top 0.254: GEN16.10 69.58,14.72 v71.12,16.26
  Bottom 0.406: v71.12,16.26 73.91,19.05 JACK7.2
RES
  Top 0.508: IC2.9 17.27,75.18 15.09,77.37 R1.2 10.31,77.37 4.57,71.63 4.57,55.37 7.11,52.83 9.14,52.83 12.7,52.83 14.73,50.8 14.73,45.72 14.73,45.21 17.78,42.16 32,42.16 33.53,40.64 33.53,5.08 32,3.56 28.19,3.56 JP3.5
SCK
  Top 0.254: 73.66,127.51 69.11,127.51 GEN1.7 | 73.66,119.89 69.11,119.89 GEN2.7 | 73.66,112.27 69.11,112.27 GEN3.7 | 73.66,104.65 69.11,104.65 GEN4.7 | GEN5.7 73.15,97.03 73.66,97.03 | GEN6.7 73.65,89.42 73.66,89.41 | GEN7.7 73.65,81.8 73.66,81.79 | GEN8.7 73.65,74.18 73.66,74.17 | GEN9.7 73.65,66.56 73.66,66.55 | 73.66,58.93 73.65,58.94 GEN10.7 | GEN12.7 73.65,43.7 73.66,43.69 | GEN13.7 73.65,36.08 73.66,36.07 | GEN14.7 73.65,28.46 73.66,28.45 | GEN15.7 73.65,20.84 73.66,20.83 | GEN16.7 73.14,13.22 73.15,13.21 | GEN11.7 73.65,51.32 73.66,51.31
  Top 0.406: 71.63,134.37 73.66,132.33 73.66,128.02 | 73.66,128.02 73.66,127.51 73.66,127 | 73.66,127 73.66,120.4 | 73.66,120.4 73.66,119.89 73.66,119.38 | 73.66,119.38 73.66,112.78 | 73.66,112.78 73.66,112.27 73.66,111.76 | 73.66,111.76 73.66,105.16 | 73.66,105.16 73.66,104.65 73.66,104.14 | 73.66,97.54 73.66,97.03 73.66,96.52 | 73.66,97.54 73.66,104.14 | 73.66,96.52 73.66,89.92 | 73.66,89.92 73.66,89.41 73.66,88.9 | 73.66,88.9 73.66,82.3 | 73.66,82.3 73.66,81.79 73.66,81.28 | 73.66,81.28 73.66,74.68 | 73.66,74.68 73.66,74.17 73.66,73.66 | 73.66,73.66 73.66,67.06 | 73.66,67.06 73.66,66.55 73.66,66.04 | 73.66,66.04 73.66,59.44 | 73.66,59.44 73.66,58.93 73.66,58.42 | 73.66,51.82 73.66,51.31 73.66,50.8 | 73.66,51.82 73.66,58.42 | 73.66,50.8 73.66,44.2 | 73.66,44.2 73.66,43.69 73.66,43.18 | 73.66,43.18 73.66,36.58 | 73.66,36.58 73.66,36.07 73.66,35.56 | 73.66,35.56 73.66,28.96 | 73.66,28.96 73.66,28.45 73.66,27.94 | 73.66,27.94 73.66,21.34 | 73.66,21.34 73.66,20.83 73.66,20.32 | 73.66,20.32 73.66,13.72 73.15,13.21 | 73.66,21.34 73.15,20.83 73.66,20.32 | 73.66,28.96 73.15,28.45 73.66,27.94 | 73.66,36.58 73.15,36.07 73.66,35.56 | 73.66,44.2 73.15,43.69 73.66,43.18 | 73.66,59.44 73.15,58.93 73.66,58.42 | 73.66,67.06 73.15,66.55 73.66,66.04 | 73.66,74.68 73.15,74.17 73.66,73.66 | 73.66,82.3 73.15,81.79 73.66,81.28 | 73.66,89.92 73.15,89.41 73.66,88.9 | 73.66,105.16 73.15,104.65 73.66,104.14 | 73.66,112.78 73.15,112.27 73.66,111.76 | 73.66,120.4 73.15,119.89 73.66,119.38 | 73.66,128.02 73.15,127.51 73.66,127 | 73.66,97.54 73.15,97.03 73.66,96.52 | 73.66,51.82 73.15,51.31 73.66,50.8
  Top 0.508: 71.63,134.37 71.19,134.81 37.27,134.81 35.05,132.59 35.05,130.43 R2.1 33.02,128.4 33.02,122.94 15.75,105.66 15.75,90.93 IC2.4
SCKB
  Top 0.508: JP3.3 27.49,7.62 28.71,6.4 31.95,6.4 32,6.35 32.39,6.73 32.39,40.26 31.5,41.15 17.27,41.15 13.72,44.7 13.72,49.78 11.68,51.82 6.6,51.82 3.56,54.86 3.56,72.14 10.67,79.25 15.24,79.25 16.76,77.72 IC2.8
SDATA  (via drill 0.5 pad 1.3)
  Top 0.254: GEN16.6 69.07,12.72 v70.1,12.19 | v70.1,19.81 69.09,20.32 68.38,20.32 GEN15.6 | v70.1,27.43 69.07,27.96 GEN14.6 | v70.1,35.05 69.07,35.58 GEN13.6 | v70.1,42.67 69.07,43.2 GEN12.6 | v70.1,50.29 69.07,50.82 GEN11.6 | v70.1,57.91 69.07,58.44 GEN10.6 | v70.1,65.53 69.07,66.06 GEN9.6 | v70.1,73.15 69.07,73.68 GEN8.6 | v70.1,80.77 69.07,81.3 GEN7.6 | v70.1,88.39 69.07,88.92 GEN6.6 | GEN5.6 68.51,96.52 69.09,96.52 v70.1,96.01 | v70.1,103.63 69.07,104.16 GEN4.6 | v70.1,111.25 69.07,111.78 GEN3.6 | v70.1,118.87 69.07,119.4 GEN2.6 | v70.1,126.49 69.07,127.02 GEN1.6 | 35.31,126.75 R3.1
  Top 0.508: v68.58,133.63 63.49,133.63 63.45,133.67 38.16,133.67 36.58,132.08 36.58,131.6 36.47,131.49 36.47,129.11 36.58,129 36.58,128.05 35.28,126.75 R3.1 34.92,123.31 16.76,105.16 16.76,92.46 IC2.3
  Bottom 0.305: v70.1,12.19 v70.1,19.81 v70.1,27.43 v70.1,35.05 v70.1,42.67 v70.1,50.29 v70.1,57.91 v70.1,65.53 v70.1,73.15 v70.1,80.77 v70.1,88.39 v70.1,96.01 v70.1,103.63 v70.1,111.25 v70.1,118.87 v70.1,126.49 70.1,132.23 v68.58,133.63
VCC  (via drill 0.5 pad 1.3)
  Top 0.254: 61.47,128.52 GEN1.2 | 61.47,120.9 GEN2.2 | GEN3.2 61.48,113.28 | GEN4.2 61.46,105.66 | GEN5.2 61.46,98.04 | GEN6.2 61.46,90.42 | GEN7.2 61.46,82.8 | GEN8.2 61.46,75.18 | GEN9.2 61.46,67.56 | GEN10.2 61.46,59.94 | GEN11.2 61.46,52.32 | GEN12.2 61.46,44.7 | GEN13.2 61.46,37.08 | GEN14.2 61.46,29.46 | GEN15.2 61.46,21.84 | GEN16.2 61.46,14.22 | C15.1 37.21,69.97 | 52.58,128.27 52.32,128.02 | 52.58,120.65 52.32,120.4 | 52.58,113.03 52.32,112.78 | 52.58,105.41 52.32,105.16 | 56.9,105.41 57.15,105.41 | 52.58,90.17 52.32,89.92 | 52.58,82.55 52.32,82.3 | 52.58,74.93 52.32,74.68 | 56.9,74.93 57.15,74.93 | 52.58,67.31 52.32,67.06 | 52.58,59.69 52.32,59.44 | 52.58,52.07 52.32,51.82 | 56.9,52.07 56.64,51.82 | 57.4,51.82 57.15,52.07 | 56.9,44.45 56.64,44.2 | 57.4,44.2 57.15,44.45 | 52.58,36.83 52.32,36.58 | 54.1,36.58 54.36,36.83 54.61,36.58 | 56.9,36.83 56.64,36.58 | 57.4,36.58 57.15,36.83 | 52.32,28.96 52.58,29.21 52.83,28.96 | 56.9,29.21 56.64,28.96 | 57.4,28.96 57.15,29.21 | 52.58,21.59 52.32,21.34 | 56.9,21.59 56.64,21.34 | 57.4,21.34 57.15,21.59 | 54.1,13.72 54.36,13.97 54.61,13.72 | 52.58,13.97 52.32,13.72 | 56.9,13.97 56.64,13.72 | 57.4,13.72 57.15,13.97 | 54.36,21.59 54.1,21.34 54.61,21.34 54.36,21.59
  Top 0.305: 57.02,129.16 C3.2 56.9,129.42 | 57.02,121.54 C9.2 56.9,121.8 | 60.96,128.02 61.47,128.52 | GEN1.2 | 60.96,120.4 61.47,120.9 | GEN2.2 | 61.48,113.28 61.47,113.28 60.96,112.78 | 56.64,112.78 56.9,112.78 57.4,112.78 | 54.61,112.78 54.36,112.78 54.1,112.78 | 61.46,105.66 60.96,105.16 | 54.36,105.41 54.36,105.16 | 61.46,98.04 60.96,97.54 | 57.02,97.66 56.9,97.54 | 61.46,90.42 60.96,89.92 | 56.9,89.92 56.64,89.92 | 54.61,89.92 54.36,89.92 | 56.9,89.92 57.4,89.92 | 54.36,89.92 54.1,89.92 | 54.36,90.17 54.36,89.92 | 57.02,90.04 56.9,89.92 | 61.46,82.8 60.96,82.3 | 56.64,82.3 56.9,82.3 57.4,82.3 | 54.61,82.3 54.36,82.3 | 54.36,82.3 54.1,82.3 | 54.36,82.55 54.36,82.3 | 61.46,75.18 60.96,74.68 | 54.61,74.68 54.36,74.68 | 54.36,74.68 54.1,74.68 | 54.36,74.93 54.36,74.68 | 57.02,74.8 56.9,74.68 | 61.46,67.56 60.96,67.06 | 56.9,67.06 56.64,67.06 | 54.61,67.06 54.36,67.06 | 56.9,67.06 57.15,67.06 | 54.36,67.06 54.1,67.06 | 54.36,67.31 54.36,67.06 | 57.02,67.18 56.9,67.06 | 61.46,59.94 60.96,59.44 | 57.15,59.44 56.9,59.44 56.64,59.44 | 54.61,59.44 54.36,59.44 54.1,59.44 | 56.9,60.84 C44.2 | 61.46,52.32 60.96,51.82 | 56.9,51.82 56.64,51.82 | 54.61,51.82 54.36,51.82 | 56.9,51.82 57.4,51.82 | 54.36,51.82 54.1,51.82 | 54.36,52.07 54.36,51.82 | 57.02,51.94 56.9,51.82 | 61.46,44.7 60.96,44.2 | 56.9,44.2 56.64,44.2 | 54.61,44.2 54.36,44.2 | 56.9,44.2 57.4,44.2 | 54.36,44.2 54.1,44.2 | 54.36,44.45 54.36,44.2 | 57.02,44.32 56.9,44.2 | 61.46,37.08 60.96,36.58 | 56.9,36.58 56.64,36.58 | 54.61,36.58 54.36,36.58 | 56.9,36.58 57.4,36.58 | 54.36,36.58 54.1,36.58 | 54.36,36.83 54.36,36.58 | 57.02,36.7 56.9,36.58 | 61.46,29.46 60.96,28.96 | 56.9,28.96 56.64,28.96 | 56.9,28.96 57.4,28.96 | 52.83,28.96 52.81,28.96 52.32,28.96
  Top 0.305: 57.02,29.08 56.9,28.96 | 61.46,21.84 60.96,21.34 | 56.9,21.34 56.64,21.34 | 56.9,21.34 57.4,21.34 | 52.83,21.34 52.81,21.34 52.32,21.34 | 54.36,21.59 54.36,21.34 | 57.02,21.46 56.9,21.34 | 61.46,14.22 60.96,13.72 | 56.9,13.72 57.4,13.72 | 56.9,13.72 56.64,13.72 | 54.61,13.72 54.36,13.72 | 54.36,13.72 54.1,13.72 | 54.36,13.72 54.36,13.97 | 57.02,13.84 56.9,13.72 | 15.62,72.64 C16.1 | 14.73,74.42 14.73,74.68
  Top 0.356: 52.32,29.21 52.07,28.96 | 52.32,36.83 52.07,36.58 | 52.32,44.45 52.07,44.2 | 52.32,52.07 52.07,51.82 | 52.32,59.69 52.07,59.44 | 52.32,67.31 52.07,67.06 | 52.32,74.93 52.07,74.68 | 52.32,82.55 52.07,82.3 | 52.32,90.17 52.07,89.92 | 52.32,97.79 52.07,97.54 | 52.32,105.41 52.07,105.16 | 52.32,113.03 52.07,112.78 | 52.32,120.65 52.07,120.4 | 52.32,128.27 52.07,128.02
  Top 0.406: C19.+ 52.81,128.02 | 52.81,128.02 54.1,128.02 | 54.1,128.02 54.36,128.02 | C4.2 54.36,128.27 | 54.36,128.27 54.36,128.02 | C8.+ 52.81,120.4 | 54.36,120.4 54.1,120.4 | 54.1,120.4 52.81,120.4 | C6.2 54.36,120.65 | 54.36,120.65 54.36,120.4 | 56.9,128.02 56.64,128.02 | 56.64,128.02 54.61,128.02 | 54.61,128.02 54.36,128.02 | 56.9,128.02 57.15,128.02 | 57.15,128.02 60.96,128.02 | 56.9,120.4 56.64,120.4 | 56.64,120.4 54.61,120.4 | 54.61,120.4 54.36,120.4 | 56.9,120.4 57.15,120.4 | 57.15,120.4 60.96,120.4 | 56.64,112.78 54.61,112.78 | 57.4,112.78 60.96,112.78 | 54.1,112.78 52.81,112.78 | 52.81,112.78 C12.+ | C10.2 54.36,113.03 | 54.36,113.03 54.36,112.78 | C13.2 57.02,112.9 56.9,112.78 | 56.9,129.42 56.9,128.27 | 56.9,128.27 56.9,128.02 | 56.9,121.8 56.9,120.65 | 56.9,120.65 56.9,120.4 | 56.9,105.16 56.64,105.16 | 56.64,105.16 54.61,105.16 | 54.61,105.16 54.36,105.16 54.1,105.16 | 56.9,105.16 57.4,105.16 | 57.4,105.16 60.96,105.16 | 54.1,105.16 52.81,105.16 | 52.81,105.16 C18.+ | C14.2 54.36,105.41 | C20.2 57.02,105.28 56.9,105.16 | 57.4,97.54 60.96,97.54 | 52.81,97.54 54.1,97.54 | 54.1,97.54 54.36,97.54 | 52.81,97.54 C23.+ | C21.2 54.36,97.79 | 54.36,97.79 54.36,97.54 | C24.2 57.02,97.66 | 56.64,89.92 54.61,89.92 | 57.4,89.92 60.96,89.92 | 54.1,89.92 52.81,89.92 | 52.81,89.92 C27.+ | C25.2 54.36,90.17 | C28.2 57.02,90.04 | 56.64,82.3 54.61,82.3 | 57.4,82.3 60.96,82.3 | 52.81,82.3 54.1,82.3 | C29.2 54.36,82.55 | C32.2 57.02,82.42 56.9,82.3 | 56.64,74.68 56.9,74.68 57.4,74.68 | 56.64,74.68 54.61,74.68 | 57.4,74.68 60.96,74.68 | 54.1,74.68 52.81,74.68 | 52.81,74.68 C35.+ | C33.2 54.36,74.93 | C36.2 57.02,74.8 | 56.64,67.06 54.61,67.06 | 57.4,67.06 57.15,67.06 56.64,67.06 | 57.4,67.06 60.96,67.06
  Top 0.406: 54.1,67.06 52.81,67.06 | 52.81,67.06 C39.+ | C37.2 54.36,67.31 | C40.2 57.02,67.18 | 60.96,59.44 57.15,59.44 | 56.64,59.44 54.61,59.44 | 54.1,59.44 52.81,59.44 | 52.81,59.44 C43.+ | 54.36,59.44 54.36,59.69 | 54.36,59.69 C41.2 | 56.9,59.44 56.9,59.69 | 56.9,59.69 56.9,60.84 | 54.61,51.82 56.64,51.82 57.4,51.82 60.96,51.82 | 54.1,51.82 52.81,51.82 | 52.81,51.82 C47.+ | C45.2 54.36,52.07 | C48.2 57.02,51.94 | 54.61,44.2 56.64,44.2 57.4,44.2 60.96,44.2 | 54.1,44.2 52.81,44.2 | 52.81,44.2 C51.+ | C49.2 54.36,44.45 | C52.2 57.02,44.32 | 60.96,36.58 57.4,36.58 56.64,36.58 54.61,36.58 54.1,36.58 52.81,36.58 | 52.81,36.58 C55.+ | C53.2 54.36,36.83 | C56.2 57.02,36.7 | 54.36,28.96 56.64,28.96 57.4,28.96 60.96,28.96 | 54.36,28.96 52.83,28.96 52.32,28.96 52.07,28.96 v47.75,28.96 | 52.81,28.96 C59.+ | C57.2 54.36,28.96 | C60.2 57.02,29.08 | 60.96,21.34 57.4,21.34 56.64,21.34 54.61,21.34 54.36,21.34 54.1,21.34 52.83,21.34 52.32,21.34 52.07,21.34 | 52.81,21.34 C63.+ | C61.2 54.36,21.59 | C64.2 57.02,21.46 | 60.96,13.72 57.4,13.72 56.64,13.72 54.61,13.72 54.1,13.72 52.81,13.72 | 52.81,13.72 C67.+ | 54.36,13.97 C65.2 | C68.2 57.02,13.84 | 52.81,128.02 52.32,128.02 52.07,128.02 v47.75,128.02 | 52.81,120.4 52.32,120.4 52.07,120.4 v47.75,120.4 | 52.81,112.78 52.32,112.78 52.07,112.78 v47.75,112.78 | 52.81,105.16 52.32,105.16 52.07,105.16 v47.75,105.16 | 52.81,97.54 52.07,97.54 v47.75,97.54 | 52.81,89.92 52.32,89.92 52.07,89.92 v47.75,89.92 | 52.81,82.3 52.32,82.3 52.07,82.3 v47.75,82.3 | 52.81,74.68 52.32,74.68 52.07,74.68 v47.75,74.68 | 52.81,67.06 52.32,67.06 52.07,67.06 v47.75,67.06 | 52.81,59.44 52.32,59.44 52.07,59.44 v47.75,59.44 | 52.81,51.82 52.32,51.82 52.07,51.82 v47.75,51.82
  Top 0.406: 52.81,44.2 52.32,44.2 | 52.32,44.2 52.07,44.2 v47.75,44.2 | 52.81,36.58 52.32,36.58 52.07,36.58 v47.75,36.58 | 52.07,21.34 v47.75,21.34 | 52.81,13.72 52.32,13.72 52.07,13.72 | 52.07,13.72 v47.75,13.72 | 37.21,69.97 37.08,70.1 | 54.36,128.27 54.1,128.02 | 54.36,128.27 54.61,128.02 | 56.9,128.27 56.64,128.02 | 56.9,128.27 57.15,128.02 | 54.36,120.65 54.1,120.4 | 54.36,120.65 54.61,120.4 | 56.9,120.65 56.64,120.4 | 56.9,120.65 57.15,120.4 | 54.36,113.03 54.1,112.78 | 54.1,112.78 54.61,112.78 | 54.61,112.78 54.36,113.03 | 56.64,112.78 56.9,113.03 57.15,113.03 57.4,112.78 | 56.64,112.78 57.4,112.78 | 54.1,105.16 54.36,105.41 | 54.36,105.41 54.61,105.16 | 56.64,105.16 56.9,105.41 | 57.15,105.41 57.4,105.16 | 54.36,90.17 54.1,89.92 | 54.1,89.92 54.61,89.92 | 54.61,89.92 54.36,90.17 | 56.9,90.17 56.64,89.92 | 56.64,89.92 57.4,89.92 | 57.4,89.92 57.15,90.17 | 54.36,82.55 54.1,82.3 | 54.1,82.3 54.61,82.3 | 54.61,82.3 54.36,82.55 | 56.9,82.55 56.64,82.3 | 56.64,82.3 57.4,82.3 | 57.4,82.3 57.15,82.55 | 54.36,74.93 54.1,74.68 | 54.1,74.68 54.61,74.68 | 54.61,74.68 54.36,74.93 | 56.64,74.68 56.9,74.93 | 57.15,74.93 57.4,74.68 | 54.36,67.31 54.1,67.06 | 54.1,67.06 54.61,67.06 | 54.61,67.06 54.36,67.31 | 56.9,67.31 56.64,67.06 | 57.4,67.06 57.15,67.31 | 54.36,59.69 54.1,59.44 | 54.1,59.44 54.61,59.44 | 54.61,59.44 54.36,59.69 | 56.9,59.69 56.64,59.44 | 56.64,59.44 57.15,59.44 | 57.15,59.44 56.9,59.69 | 54.36,52.07 54.1,51.82 | 54.1,51.82 54.61,51.82 | 54.61,51.82 54.36,52.07 | 54.36,44.45 54.1,44.2 | 54.1,44.2 54.61,44.2 | 54.61,44.2 54.36,44.45 | 52.58,44.45 52.32,44.2 | C31.+ 52.81,82.3 | 54.61,97.54 56.64,97.54 | 56.64,97.54 56.9,97.54 57.4,97.54 | 54.36,97.79 54.1,97.54 | 54.36,97.54 54.61,97.54
  Top 0.406: 54.61,97.54 54.36,97.79 | 56.9,97.79 56.64,97.54 | 57.4,97.54 57.15,97.79 | 52.32,13.97 52.07,13.72 | 52.32,21.59 52.07,21.34
  Top 0.508: IC2.30 37.08,70.1 v40.13,70.1 | R3.2 R2.2 38.61,130.3 | 38.61,130.3 39.37,130.3 v39.62,130.05 | IC2.10 15.62,72.64 | C16.1 14.73,73.03 14.73,74.42 | R1.1 14.07,74.52 14.73,74.68 14.99,74.68 | 14.99,74.68 v15.75,74.68 | 14.73,74.42 14.99,74.68 | 14.73,74.42 14.48,74.68 | 38.61,130.3 37.85,129.54
  Bottom 0.508: 37.85,10.16 JP2.4
  pour Bottom: 46.74,4.06 46.74,7.62 48.77,9.14 48.77,131.06 37.08,131.06 37.08,8.64 40.13,8.64 40.13,4.06
  pour Bottom: 37.08,73.66 16.76,73.66 14.73,74.17 14.73,80.77 17.78,81.79 37.08,81.79
  pour Bottom: 37.08,13.72 30.48,13.72 28.96,12.19 28.96,9.14 30.48,7.62 39.62,7.62 40.13,7.11 40.13,13.72

### Text on the board
Top: TOP-SIGNAL
Bottom: BOTTOM-GND&VCC
tNames: Delay & Sum Audio Beamforming / / Maciej Nawrocki / praca inzynierska / EiT Poznan 2018
tValues: TXD | RXD | VCC | MISO | VDD | MOSI | SCKB | RES | GND | GND